# Altium schematic sheet FPGA.SchDoc: FIT_PM12 board
size 420 x 297 mm; CheckedBy: G.Kasprowicz; Author: INR Moscow; CompanyName: WUT ISE; DrawnBy: M.Podgórski; Organization: WUT ISE; Address1: PW ISE; Address2: Nowowiejska 15/19 00-665 Warsaw; Address3: gkasprow@gmail.com; DocumentNumber: 34; Revision: 2; SheetNumber: 22; SheetTotal: 34; ModifiedBy: -; CheckedDate: -; Title2: FPGA TOP; DivGrp: WUT ISE; Designer: INR RAS; ModifiedDate: -; ProjectName: Sensor Box
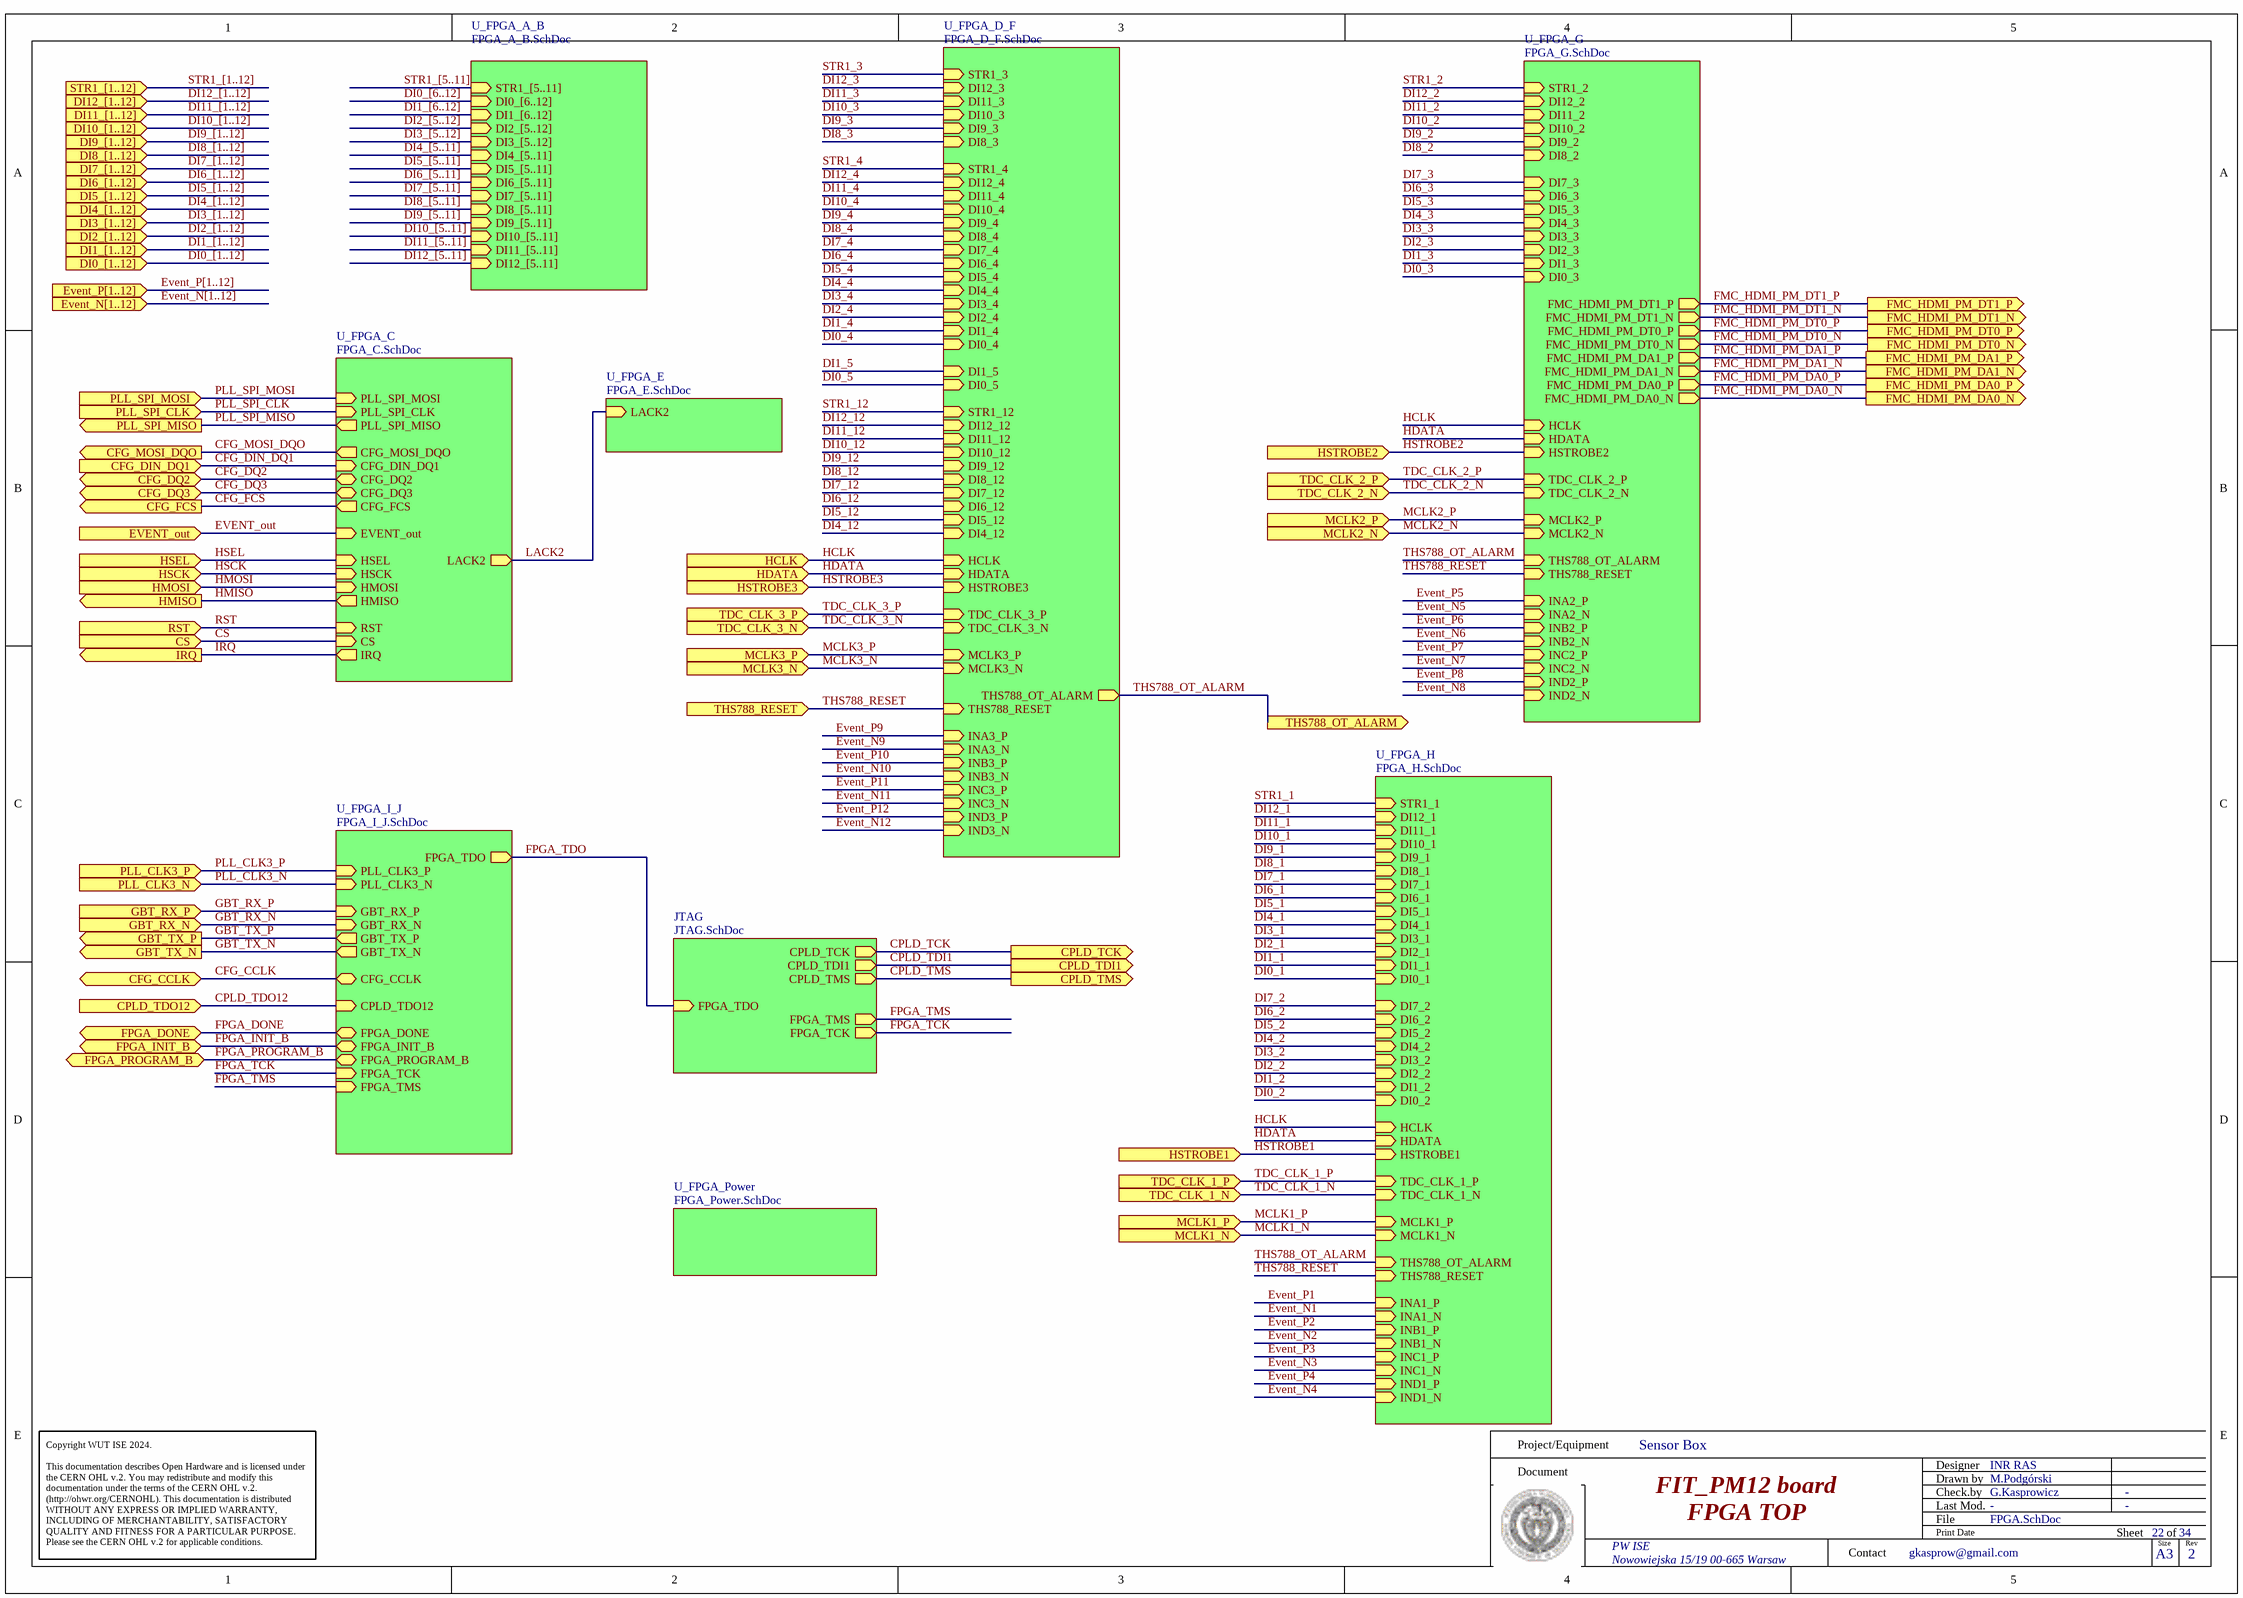
[diagram p0: FPGA.SchDoc]

## Sub-sheets
JTAG = JTAG.SchDoc: FPGA_TDO (in), FPGA_TCK (out), FPGA_TMS (out), CPLD_TDI1 (out), CPLD_TMS (out), CPLD_TCK (out)
U_FPGA_A_B = FPGA_A_B.SchDoc: STR1_[5..11] (in), DI0_[6..12] (in), DI1_[6..12] (in), DI2_[5..12] (in), DI3_[5..12] (in), DI4_[5..11] (in), DI5_[5..11] (in), DI6_[5..11] (in), DI7_[5..11] (in), DI8_[5..11] (in), DI9_[5..11] (in), DI10_[5..11] (in), DI11_[5..11] (in), DI12_[5..11] (in)
U_FPGA_C = FPGA_C.SchDoc: PLL_SPI_MOSI (in), CFG_MOSI_DQO (out), CFG_DIN_DQ1 (in), CFG_DQ2 (bidir), CFG_DQ3 (bidir), CFG_FCS (out), LACK2 (out), PLL_SPI_CLK (in), HSCK (in), EVENT_out (in), PLL_SPI_MISO (out), HMISO (out), HSEL (in), HMOSI (in), CS (in), IRQ (out), RST (in)
U_FPGA_D_F = FPGA_D_F.SchDoc: DI8_3 (in), DI4_4 (in), DI5_4 (in), DI11_4 (in), DI1_5 (in), DI12_3 (in), STR1_3 (in), STR1_4 (in), DI0_5 (in), DI2_4 (in), DI12_4 (in), DI3_4 (in), DI10_4 (in), DI9_4 (in), DI6_4 (in), DI1_4 (in), DI8_4 (in), DI0_4 (in), DI7_4 (in), DI10_3 (in), DI11_3 (in), DI9_3 (in), DI11_12 (in), DI12_12 (in), DI5_12 (in), DI7_12 (in), DI6_12 (in), DI10_12 (in), DI4_12 (in), DI8_12 (in), DI9_12 (in), STR1_12 (in), HCLK (in), HDATA (in), THS788_OT_ALARM (out), THS788_RESET (in), HSTROBE3 (in), TDC_CLK_3_P (in), TDC_CLK_3_N (in), MCLK3_P (in), MCLK3_N (in), INA3_P (in), INA3_N (in), INB3_P (in), INB3_N (in), INC3_P (in), INC3_N (in), IND3_P (in), IND3_N (in)
U_FPGA_E = FPGA_E.SchDoc: LACK2 (in)
U_FPGA_G = FPGA_G.SchDoc: DI8_2 (in), DI10_2 (in), DI9_2 (in), DI12_2 (in), DI11_2 (in), DI0_3 (in), STR1_2 (in), FMC_HDMI_PM_DA0_P (out), FMC_HDMI_PM_DA0_N (out), DI7_3 (in), DI6_3 (in), FMC_HDMI_PM_DT1_P (out), FMC_HDMI_PM_DT1_N (out), DI5_3 (in), DI4_3 (in), DI1_3 (in), DI2_3 (in), FMC_HDMI_PM_DA1_P (out), FMC_HDMI_PM_DA1_N (out), FMC_HDMI_PM_DT0_P (out), FMC_HDMI_PM_DT0_N (out), DI3_3 (in), HCLK (in), HDATA (in), THS788_OT_ALARM (in), THS788_RESET (in), HSTROBE2 (in), TDC_CLK_2_P (in), TDC_CLK_2_N (in), MCLK2_P (in), MCLK2_N (in), INA2_P (in), INA2_N (in), INB2_P (in), INB2_N (in), INC2_P (in), INC2_N (in), IND2_P (in), IND2_N (in)
U_FPGA_H = FPGA_H.SchDoc: DI4_1 (in), DI2_1 (in), DI3_1 (in), DI5_1 (in), DI6_1 (in), DI12_1 (in), STR1_1 (in), DI1_1 (in), DI7_1 (in), DI8_1 (in), DI9_1 (in), DI10_1 (in), DI11_1 (in), DI0_1 (in), DI0_2 (in), DI3_2 (in), DI7_2 (in), DI2_2 (in), DI1_2 (in), DI6_2 (in), DI4_2 (in), DI5_2 (in), HCLK (in), HDATA (in), THS788_OT_ALARM (in), THS788_RESET (in), TDC_CLK_1_P (in), TDC_CLK_1_N (in), HSTROBE1 (in), MCLK1_P (in), MCLK1_N (in), INA1_P (in), INA1_N (in), INB1_P (in), INB1_N (in), INC1_P (in), INC1_N (in), IND1_P (in), IND1_N (in)
U_FPGA_I_J = FPGA_I_J.SchDoc: FPGA_TDO (out), CPLD_TDO12 (in), CFG_CCLK (bidir), FPGA_DONE (bidir), FPGA_INIT_B (bidir), FPGA_PROGRAM_B (bidir), FPGA_TMS (in), FPGA_TCK (in), GBT_TX_P (out), GBT_TX_N (out), GBT_RX_P (in), PLL_CLK3_P (in), GBT_RX_N (in), PLL_CLK3_N (in)
U_FPGA_Power = FPGA_Power.SchDoc: no entries

## Ports
CFG_CCLK (bidir), CFG_DIN_DQ1 (in), CFG_DQ2 (bidir), CFG_DQ3 (bidir), CFG_FCS (out), CFG_MOSI_DQO (out), CPLD_TCK (out), CPLD_TDI1 (out), CPLD_TDO12 (in), CPLD_TMS (out), CS (in), DI0_[1..12] (in), DI1_[1..12] (in), DI2_[1..12] (in), DI3_[1..12] (in), DI4_[1..12] (in), DI5_[1..12] (in), DI6_[1..12] (in), DI7_[1..12] (in), DI8_[1..12] (in), DI9_[1..12] (in), DI10_[1..12] (in), DI11_[1..12] (in), DI12_[1..12] (in), Event_N[1..12] (in), EVENT_out (in), Event_P[1..12] (in), FMC_HDMI_PM_DA0_N (out), FMC_HDMI_PM_DA0_P (out), FMC_HDMI_PM_DA1_N (out), FMC_HDMI_PM_DA1_P (out), FMC_HDMI_PM_DT0_N (out), FMC_HDMI_PM_DT0_P (out), FMC_HDMI_PM_DT1_N (out), FMC_HDMI_PM_DT1_P (out), FPGA_DONE (bidir), FPGA_INIT_B (bidir), FPGA_PROGRAM_B (bidir), GBT_RX_N (in), GBT_RX_P (in), GBT_TX_N (out), GBT_TX_P (out), HCLK (in), HDATA (in), HMISO (out), HMOSI (in), HSCK (in), HSEL (in), HSTROBE1 (in), HSTROBE2 (in), HSTROBE3 (in), IRQ (out), MCLK1_N (in), MCLK1_P (in), MCLK2_N (in), MCLK2_P (in), MCLK3_N (in), MCLK3_P (in), PLL_CLK3_N (in), PLL_CLK3_P (in), PLL_SPI_CLK (in), PLL_SPI_MISO (out), PLL_SPI_MOSI (in), RST (in), STR1_[1..12] (in), TDC_CLK_1_N (in), TDC_CLK_1_P (in), TDC_CLK_2_N (in), TDC_CLK_2_P (in), TDC_CLK_3_N (in), TDC_CLK_3_P (in), THS788_OT_ALARM (out), THS788_RESET (in)

## Nets
CFG_CCLK: port CFG_CCLK, sheet U_FPGA_I_J/CFG_CCLK
CFG_DIN_DQ1: port CFG_DIN_DQ1, sheet U_FPGA_C/CFG_DIN_DQ1
CFG_DQ2: port CFG_DQ2, sheet U_FPGA_C/CFG_DQ2
CFG_DQ3: port CFG_DQ3, sheet U_FPGA_C/CFG_DQ3
CFG_FCS: port CFG_FCS, sheet U_FPGA_C/CFG_FCS
CFG_MOSI_DQO: port CFG_MOSI_DQO, sheet U_FPGA_C/CFG_MOSI_DQO
CPLD_TCK: port CPLD_TCK, sheet JTAG/CPLD_TCK
CPLD_TDI1: port CPLD_TDI1, sheet JTAG/CPLD_TDI1
CPLD_TDO12: port CPLD_TDO12, sheet U_FPGA_I_J/CPLD_TDO12
CPLD_TMS: port CPLD_TMS, sheet JTAG/CPLD_TMS
CS: port CS, sheet U_FPGA_C/CS
DI0_1: sheet U_FPGA_H/DI0_1
DI0_2: sheet U_FPGA_H/DI0_2
DI0_3: sheet U_FPGA_G/DI0_3
DI0_4: sheet U_FPGA_D_F/DI0_4
DI0_5: sheet U_FPGA_D_F/DI0_5
DI1_1: sheet U_FPGA_H/DI1_1
DI1_2: sheet U_FPGA_H/DI1_2
DI1_3: sheet U_FPGA_G/DI1_3
DI1_4: sheet U_FPGA_D_F/DI1_4
DI1_5: sheet U_FPGA_D_F/DI1_5
DI2_1: sheet U_FPGA_H/DI2_1
DI2_2: sheet U_FPGA_H/DI2_2
DI2_3: sheet U_FPGA_G/DI2_3
DI2_4: sheet U_FPGA_D_F/DI2_4
DI3_1: sheet U_FPGA_H/DI3_1
DI3_2: sheet U_FPGA_H/DI3_2
DI3_3: sheet U_FPGA_G/DI3_3
DI3_4: sheet U_FPGA_D_F/DI3_4
DI4_1: sheet U_FPGA_H/DI4_1
DI4_2: sheet U_FPGA_H/DI4_2
DI4_3: sheet U_FPGA_G/DI4_3
DI4_4: sheet U_FPGA_D_F/DI4_4
DI4_12: sheet U_FPGA_D_F/DI4_12
DI5_1: sheet U_FPGA_H/DI5_1
DI5_2: sheet U_FPGA_H/DI5_2
DI5_3: sheet U_FPGA_G/DI5_3
DI5_4: sheet U_FPGA_D_F/DI5_4
DI5_12: sheet U_FPGA_D_F/DI5_12
DI6_1: sheet U_FPGA_H/DI6_1
DI6_2: sheet U_FPGA_H/DI6_2
DI6_3: sheet U_FPGA_G/DI6_3
DI6_4: sheet U_FPGA_D_F/DI6_4
DI6_12: sheet U_FPGA_D_F/DI6_12
DI7_1: sheet U_FPGA_H/DI7_1
DI7_2: sheet U_FPGA_H/DI7_2
DI7_3: sheet U_FPGA_G/DI7_3
DI7_4: sheet U_FPGA_D_F/DI7_4
DI7_12: sheet U_FPGA_D_F/DI7_12
DI8_1: sheet U_FPGA_H/DI8_1
DI8_2: sheet U_FPGA_G/DI8_2
DI8_3: sheet U_FPGA_D_F/DI8_3
DI8_4: sheet U_FPGA_D_F/DI8_4
DI8_12: sheet U_FPGA_D_F/DI8_12
DI9_1: sheet U_FPGA_H/DI9_1
DI9_2: sheet U_FPGA_G/DI9_2
DI9_3: sheet U_FPGA_D_F/DI9_3
DI9_4: sheet U_FPGA_D_F/DI9_4
DI9_12: sheet U_FPGA_D_F/DI9_12
DI10_1: sheet U_FPGA_H/DI10_1
DI10_2: sheet U_FPGA_G/DI10_2
DI10_3: sheet U_FPGA_D_F/DI10_3
DI10_4: sheet U_FPGA_D_F/DI10_4
DI10_12: sheet U_FPGA_D_F/DI10_12
DI11_1: sheet U_FPGA_H/DI11_1
DI11_2: sheet U_FPGA_G/DI11_2
DI11_3: sheet U_FPGA_D_F/DI11_3
DI11_4: sheet U_FPGA_D_F/DI11_4
DI11_12: sheet U_FPGA_D_F/DI11_12
DI12_1: sheet U_FPGA_H/DI12_1
DI12_2: sheet U_FPGA_G/DI12_2
DI12_3: sheet U_FPGA_D_F/DI12_3
DI12_4: sheet U_FPGA_D_F/DI12_4
DI12_12: sheet U_FPGA_D_F/DI12_12
Event_N1: sheet U_FPGA_H/INA1_N
Event_N2: sheet U_FPGA_H/INB1_N
Event_N3: sheet U_FPGA_H/INC1_N
Event_N4: sheet U_FPGA_H/IND1_N
Event_N5: sheet U_FPGA_G/INA2_N
Event_N6: sheet U_FPGA_G/INB2_N
Event_N7: sheet U_FPGA_G/INC2_N
Event_N8: sheet U_FPGA_G/IND2_N
Event_N9: sheet U_FPGA_D_F/INA3_N
Event_N10: sheet U_FPGA_D_F/INB3_N
Event_N11: sheet U_FPGA_D_F/INC3_N
Event_N12: sheet U_FPGA_D_F/IND3_N
EVENT_out: port EVENT_out, sheet U_FPGA_C/EVENT_out
Event_P1: sheet U_FPGA_H/INA1_P
Event_P2: sheet U_FPGA_H/INB1_P
Event_P3: sheet U_FPGA_H/INC1_P
Event_P4: sheet U_FPGA_H/IND1_P
Event_P5: sheet U_FPGA_G/INA2_P
Event_P6: sheet U_FPGA_G/INB2_P
Event_P7: sheet U_FPGA_G/INC2_P
Event_P8: sheet U_FPGA_G/IND2_P
Event_P9: sheet U_FPGA_D_F/INA3_P
Event_P10: sheet U_FPGA_D_F/INB3_P
Event_P11: sheet U_FPGA_D_F/INC3_P
Event_P12: sheet U_FPGA_D_F/IND3_P
FMC_HDMI_PM_DA0_N: port FMC_HDMI_PM_DA0_N, sheet U_FPGA_G/FMC_HDMI_PM_DA0_N
FMC_HDMI_PM_DA0_P: port FMC_HDMI_PM_DA0_P, sheet U_FPGA_G/FMC_HDMI_PM_DA0_P
FMC_HDMI_PM_DA1_N: port FMC_HDMI_PM_DA1_N, sheet U_FPGA_G/FMC_HDMI_PM_DA1_N
FMC_HDMI_PM_DA1_P: port FMC_HDMI_PM_DA1_P, sheet U_FPGA_G/FMC_HDMI_PM_DA1_P
FMC_HDMI_PM_DT0_N: port FMC_HDMI_PM_DT0_N, sheet U_FPGA_G/FMC_HDMI_PM_DT0_N
FMC_HDMI_PM_DT0_P: port FMC_HDMI_PM_DT0_P, sheet U_FPGA_G/FMC_HDMI_PM_DT0_P
FMC_HDMI_PM_DT1_N: port FMC_HDMI_PM_DT1_N, sheet U_FPGA_G/FMC_HDMI_PM_DT1_N
FMC_HDMI_PM_DT1_P: port FMC_HDMI_PM_DT1_P, sheet U_FPGA_G/FMC_HDMI_PM_DT1_P
FPGA_DONE: port FPGA_DONE, sheet U_FPGA_I_J/FPGA_DONE
FPGA_INIT_B: port FPGA_INIT_B, sheet U_FPGA_I_J/FPGA_INIT_B
FPGA_PROGRAM_B: port FPGA_PROGRAM_B, sheet U_FPGA_I_J/FPGA_PROGRAM_B
FPGA_TCK: sheet U_FPGA_I_J/FPGA_TCK, sheet JTAG/FPGA_TCK
FPGA_TDO: sheet U_FPGA_I_J/FPGA_TDO, sheet JTAG/FPGA_TDO
FPGA_TMS: sheet U_FPGA_I_J/FPGA_TMS, sheet JTAG/FPGA_TMS
GBT_RX_N: port GBT_RX_N, sheet U_FPGA_I_J/GBT_RX_N
GBT_RX_P: port GBT_RX_P, sheet U_FPGA_I_J/GBT_RX_P
GBT_TX_N: port GBT_TX_N, sheet U_FPGA_I_J/GBT_TX_N
GBT_TX_P: port GBT_TX_P, sheet U_FPGA_I_J/GBT_TX_P
HCLK: port HCLK, sheet U_FPGA_H/HCLK, sheet U_FPGA_D_F/HCLK, sheet U_FPGA_G/HCLK
HDATA: port HDATA, sheet U_FPGA_H/HDATA, sheet U_FPGA_D_F/HDATA, sheet U_FPGA_G/HDATA
HMISO: port HMISO, sheet U_FPGA_C/HMISO
HMOSI: port HMOSI, sheet U_FPGA_C/HMOSI
HSCK: port HSCK, sheet U_FPGA_C/HSCK
HSEL: port HSEL, sheet U_FPGA_C/HSEL
HSTROBE1: port HSTROBE1, sheet U_FPGA_H/HSTROBE1
HSTROBE2: port HSTROBE2, sheet U_FPGA_G/HSTROBE2
HSTROBE3: port HSTROBE3, sheet U_FPGA_D_F/HSTROBE3
IRQ: port IRQ, sheet U_FPGA_C/IRQ
LACK2: sheet U_FPGA_E/LACK2, sheet U_FPGA_C/LACK2
MCLK1_N: port MCLK1_N, sheet U_FPGA_H/MCLK1_N
MCLK1_P: port MCLK1_P, sheet U_FPGA_H/MCLK1_P
MCLK2_N: port MCLK2_N, sheet U_FPGA_G/MCLK2_N
MCLK2_P: port MCLK2_P, sheet U_FPGA_G/MCLK2_P
MCLK3_N: port MCLK3_N, sheet U_FPGA_D_F/MCLK3_N
MCLK3_P: port MCLK3_P, sheet U_FPGA_D_F/MCLK3_P
PLL_CLK3_N: port PLL_CLK3_N, sheet U_FPGA_I_J/PLL_CLK3_N
PLL_CLK3_P: port PLL_CLK3_P, sheet U_FPGA_I_J/PLL_CLK3_P
PLL_SPI_CLK: port PLL_SPI_CLK, sheet U_FPGA_C/PLL_SPI_CLK
PLL_SPI_MISO: port PLL_SPI_MISO, sheet U_FPGA_C/PLL_SPI_MISO
PLL_SPI_MOSI: port PLL_SPI_MOSI, sheet U_FPGA_C/PLL_SPI_MOSI
RST: port RST, sheet U_FPGA_C/RST
STR1_1: sheet U_FPGA_H/STR1_1
STR1_2: sheet U_FPGA_G/STR1_2
STR1_3: sheet U_FPGA_D_F/STR1_3
STR1_4: sheet U_FPGA_D_F/STR1_4
STR1_12: sheet U_FPGA_D_F/STR1_12
TDC_CLK_1_N: port TDC_CLK_1_N, sheet U_FPGA_H/TDC_CLK_1_N
TDC_CLK_1_P: port TDC_CLK_1_P, sheet U_FPGA_H/TDC_CLK_1_P
TDC_CLK_2_N: port TDC_CLK_2_N, sheet U_FPGA_G/TDC_CLK_2_N
TDC_CLK_2_P: port TDC_CLK_2_P, sheet U_FPGA_G/TDC_CLK_2_P
TDC_CLK_3_N: port TDC_CLK_3_N, sheet U_FPGA_D_F/TDC_CLK_3_N
TDC_CLK_3_P: port TDC_CLK_3_P, sheet U_FPGA_D_F/TDC_CLK_3_P
THS788_OT_ALARM: port THS788_OT_ALARM, sheet U_FPGA_H/THS788_OT_ALARM, sheet U_FPGA_D_F/THS788_OT_ALARM, sheet U_FPGA_G/THS788_OT_ALARM
THS788_RESET: port THS788_RESET, sheet U_FPGA_H/THS788_RESET, sheet U_FPGA_D_F/THS788_RESET, sheet U_FPGA_G/THS788_RESET

## Buses and harness runs
bus DI0_[1..12] = port DI0_[1..12]
bus DI0_[6..12] = sheet U_FPGA_A_B/DI0_[6..12]
bus DI1_[1..12] = port DI1_[1..12]
bus DI1_[6..12] = sheet U_FPGA_A_B/DI1_[6..12]
bus DI2_[1..12] = port DI2_[1..12]
bus DI2_[5..12] = sheet U_FPGA_A_B/DI2_[5..12]
bus DI3_[1..12] = port DI3_[1..12]
bus DI3_[5..12] = sheet U_FPGA_A_B/DI3_[5..12]
bus DI4_[1..12] = port DI4_[1..12]
bus DI4_[5..11] = sheet U_FPGA_A_B/DI4_[5..11]
bus DI5_[1..12] = port DI5_[1..12]
bus DI5_[5..11] = sheet U_FPGA_A_B/DI5_[5..11]
bus DI6_[1..12] = port DI6_[1..12]
bus DI6_[5..11] = sheet U_FPGA_A_B/DI6_[5..11]
bus DI7_[1..12] = port DI7_[1..12]
bus DI7_[5..11] = sheet U_FPGA_A_B/DI7_[5..11]
bus DI8_[1..12] = port DI8_[1..12]
bus DI8_[5..11] = sheet U_FPGA_A_B/DI8_[5..11]
bus DI9_[1..12] = port DI9_[1..12]
bus DI9_[5..11] = sheet U_FPGA_A_B/DI9_[5..11]
bus DI10_[1..12] = port DI10_[1..12]
bus DI10_[5..11] = sheet U_FPGA_A_B/DI10_[5..11]
bus DI11_[1..12] = port DI11_[1..12]
bus DI11_[5..11] = sheet U_FPGA_A_B/DI11_[5..11]
bus DI12_[1..12] = port DI12_[1..12]
bus DI12_[5..11] = sheet U_FPGA_A_B/DI12_[5..11]
bus Event_N[1..12] = port Event_N[1..12]
bus Event_P[1..12] = port Event_P[1..12]
bus STR1_[1..12] = port STR1_[1..12]
bus STR1_[5..11] = sheet U_FPGA_A_B/STR1_[5..11]

## Notes on the sheet
- Project/Equipment
- Document
- Designer
- Drawn by
- Check.by
- Copyright WUT ISE 2024.
  This documentation describes Open Hardware and is licensed under the CERN OHL v.2. You may redistribute and modify this documentation under the terms of the CERN OHL v.2. (http://ohwr.org/CERNOHL). This documentation is distributed WITHOUT ANY EXPRESS OR IMPLIED WARRANTY, INCLUDING OF MERCHANTABILITY, SATISFACTORY QUALITY AND FITNESS FOR A PARTICULAR PURPOSE. Please see the CERN OHL v.2 for applicable conditions.
- Contact
- File
- Last Mod.
- Print Date
- Sheet
- Size
- A3
- of
- Rev